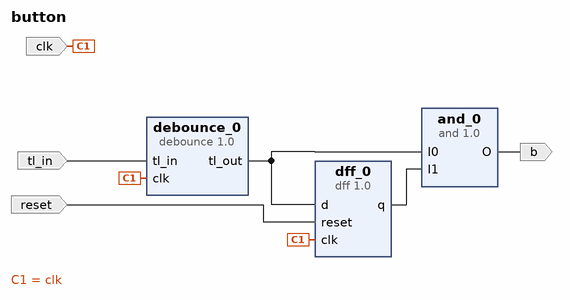
[diagram p0: block diagram of the top level]
# Vivado block design button, xc7a35tcpg236-1, Vivado 2018.2.1
create_bd_design button

create_bd_port -dir I clk
create_bd_port -dir I tl_in
create_bd_port -dir O b
create_bd_port -dir I reset

create_bd_cell -type ip -vlnv FIT:user:and:1.0 and_0
set_property -dict {CONFIG.I1_inverted true} [get_bd_cells and_0]
create_bd_cell -type ip -vlnv FIT:user:debounce:1.0 debounce_0
create_bd_cell -type ip -vlnv FIT:user:dff:1.0 dff_0

# ---- connections ----

connect_bd_net [get_bd_pins debounce_0/tl_out] [get_bd_pins dff_0/d] [get_bd_pins and_0/I0]
connect_bd_net [get_bd_ports clk] [get_bd_pins debounce_0/clk] [get_bd_pins dff_0/clk]
connect_bd_net [get_bd_ports tl_in] [get_bd_pins debounce_0/tl_in]
connect_bd_net [get_bd_pins dff_0/q] [get_bd_pins and_0/I1]
connect_bd_net [get_bd_pins and_0/O] [get_bd_ports b]
connect_bd_net [get_bd_ports reset] [get_bd_pins dff_0/reset]

validate_bd_design
save_bd_design
